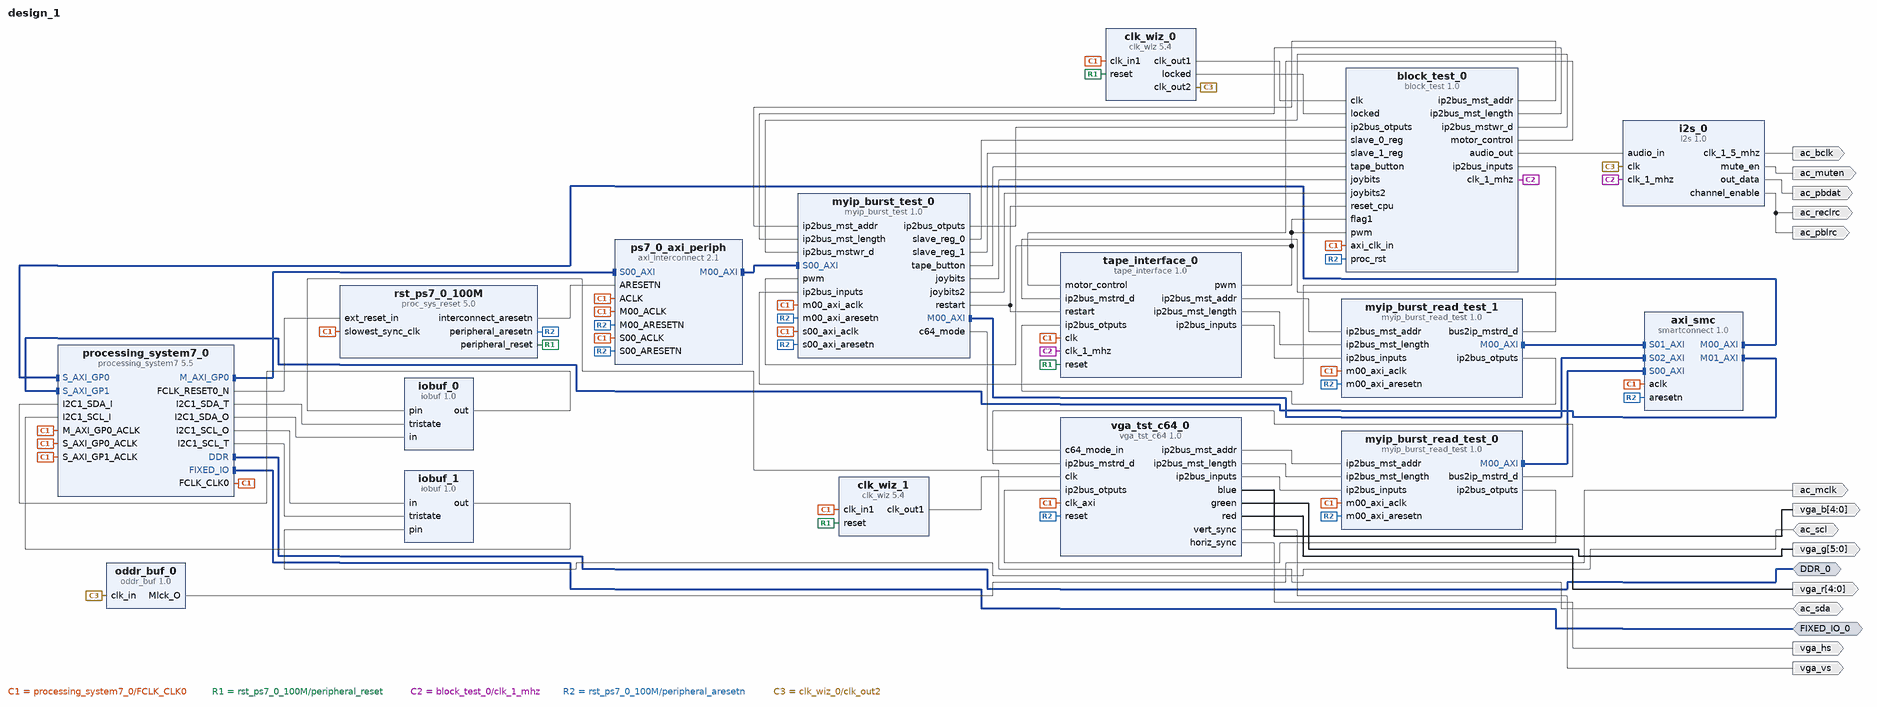
[diagram p0: block diagram of the top level]
# Vivado block design design_1, xc7z010clg400-1, Vivado 2017.1
create_bd_design design_1

create_bd_intf_port -mode Master -vlnv xilinx.com:interface:ddrx_rtl:1.0 DDR_0
create_bd_intf_port -mode Master -vlnv xilinx.com:display_processing_system7:fixedio_rtl:1.0 FIXED_IO_0
create_bd_port -dir O -from 4 -to 0 vga_r
create_bd_port -dir O -from 5 -to 0 vga_g
create_bd_port -dir O -from 4 -to 0 vga_b
create_bd_port -dir O vga_vs
create_bd_port -dir O vga_hs
create_bd_port -dir IO ac_sda
create_bd_port -dir IO ac_scl
create_bd_port -dir O ac_muten
create_bd_port -dir O ac_mclk
create_bd_port -dir O ac_bclk
create_bd_port -dir O ac_pbdat
create_bd_port -dir O ac_reclrc
create_bd_port -dir O ac_pblrc

create_bd_cell -type ip -vlnv xilinx.com:ip:clk_wiz:5.4 clk_wiz_0
set_property -dict [list \
  CONFIG.CLKOUT2_USED true \
  CONFIG.NUM_OUT_CLKS 2 \
  CONFIG.CLKOUT1_REQUESTED_OUT_FREQ 8 \
  CONFIG.CLKOUT2_REQUESTED_OUT_FREQ 12.288 \
  CONFIG.MMCM_DIVCLK_DIVIDE 1 \
  CONFIG.MMCM_CLKFBOUT_MULT_F 7.250 \
  CONFIG.MMCM_CLKOUT0_DIVIDE_F 90.625 \
  CONFIG.MMCM_CLKOUT1_DIVIDE 59 \
  CONFIG.CLKOUT1_JITTER 242.812 \
  CONFIG.CLKOUT1_PHASE_ERROR 119.384 \
  CONFIG.CLKOUT2_JITTER 223.282 \
  CONFIG.CLKOUT2_PHASE_ERROR 119.384 \
] [get_bd_cells clk_wiz_0]
create_bd_cell -type ip -vlnv user.org:user:myip_burst_read_test:1.0 myip_burst_read_test_0
create_bd_cell -type ip -vlnv xilinx.com:ip:clk_wiz:5.4 clk_wiz_1
set_property -dict [list \
  CONFIG.CLKOUT1_REQUESTED_OUT_FREQ 85.4 \
  CONFIG.MMCM_DIVCLK_DIVIDE 5 \
  CONFIG.MMCM_CLKFBOUT_MULT_F 53.375 \
  CONFIG.MMCM_CLKOUT0_DIVIDE_F 12.500 \
  CONFIG.CLKOUT1_JITTER 230.004 \
  CONFIG.CLKOUT1_PHASE_ERROR 297.994 \
] [get_bd_cells clk_wiz_1]
create_bd_cell -type ip -vlnv user.org:user:tape_interface:1.0 tape_interface_0
create_bd_cell -type ip -vlnv user.org:user:myip_burst_read_test:1.0 myip_burst_read_test_1
create_bd_cell -type ip -vlnv user.org:user:myip_burst_test:1.0 myip_burst_test_0
create_bd_cell -type ip -vlnv xilinx.com:ip:processing_system7:5.5 processing_system7_0
set_property -dict [list \
  CONFIG.PCW_UIPARAM_DDR_FREQ_MHZ 525 \
  CONFIG.PCW_CRYSTAL_PERIPHERAL_FREQMHZ 50.000000 \
  CONFIG.PCW_APU_PERIPHERAL_FREQMHZ 650 \
  CONFIG.PCW_SDIO_PERIPHERAL_FREQMHZ 50 \
  CONFIG.PCW_FPGA0_PERIPHERAL_FREQMHZ 100 \
  CONFIG.PCW_USE_S_AXI_GP0 1 \
  CONFIG.PCW_USE_S_AXI_GP1 1 \
  CONFIG.PCW_PRESET_BANK1_VOLTAGE {LVCMOS 1.8V} \
  CONFIG.PCW_UIPARAM_DDR_PARTNO {MT41K128M16 JT-125} \
  CONFIG.PCW_QSPI_PERIPHERAL_ENABLE 1 \
  CONFIG.PCW_QSPI_GRP_SINGLE_SS_ENABLE 1 \
  CONFIG.PCW_QSPI_GRP_FBCLK_ENABLE 1 \
  CONFIG.PCW_ENET0_PERIPHERAL_ENABLE 1 \
  CONFIG.PCW_ENET0_ENET0_IO {MIO 16 .. 27} \
  CONFIG.PCW_ENET0_GRP_MDIO_ENABLE 1 \
  CONFIG.PCW_SD0_PERIPHERAL_ENABLE 1 \
  CONFIG.PCW_SD0_GRP_CD_ENABLE 1 \
  CONFIG.PCW_SD0_GRP_CD_IO {MIO 47} \
  CONFIG.PCW_SD0_GRP_WP_ENABLE 1 \
  CONFIG.PCW_UART1_PERIPHERAL_ENABLE 1 \
  CONFIG.PCW_TTC0_PERIPHERAL_ENABLE 1 \
  CONFIG.PCW_USB0_PERIPHERAL_ENABLE 1 \
  CONFIG.PCW_I2C1_PERIPHERAL_ENABLE 1 \
  CONFIG.PCW_GPIO_MIO_GPIO_ENABLE 1 \
] [get_bd_cells processing_system7_0]
# 105 more settings of processing_system7_0 are not shown: defaults, MIO pin electricals, DDR timing, and values the tool derives
create_bd_cell -type ip -vlnv xilinx.com:ip:smartconnect:1.0 axi_smc
set_property -dict {CONFIG.NUM_MI 2 CONFIG.NUM_SI 3} [get_bd_cells axi_smc]
create_bd_cell -type ip -vlnv xilinx.com:ip:proc_sys_reset:5.0 rst_ps7_0_100M
create_bd_cell -type ip -vlnv xilinx.com:ip:axi_interconnect:2.1 ps7_0_axi_periph
set_property -dict {CONFIG.NUM_MI 1} [get_bd_cells ps7_0_axi_periph]
create_bd_cell -type ip -vlnv user.org:user:block_test:1.0 block_test_0
create_bd_cell -type ip -vlnv user.org:user:vga_tst_c64:1.0 vga_tst_c64_0
create_bd_cell -type ip -vlnv user.org:user:i2s:1.0 i2s_0
create_bd_cell -type ip -vlnv user.org:user:iobuf:1.0 iobuf_0
create_bd_cell -type ip -vlnv user.org:user:iobuf:1.0 iobuf_1
create_bd_cell -type ip -vlnv user.org:user:oddr_buf:1.0 oddr_buf_0

# ---- connections ----

connect_bd_intf_net [get_bd_intf_pins myip_burst_read_test_0/M00_AXI] [get_bd_intf_pins axi_smc/S00_AXI]
connect_bd_intf_net [get_bd_intf_pins axi_smc/M00_AXI] [get_bd_intf_pins processing_system7_0/S_AXI_GP0]
connect_bd_intf_net [get_bd_intf_pins axi_smc/M01_AXI] [get_bd_intf_pins processing_system7_0/S_AXI_GP1]
connect_bd_intf_net [get_bd_intf_pins myip_burst_read_test_1/M00_AXI] [get_bd_intf_pins axi_smc/S01_AXI]
connect_bd_intf_net [get_bd_intf_pins processing_system7_0/M_AXI_GP0] [get_bd_intf_pins ps7_0_axi_periph/S00_AXI]
connect_bd_intf_net [get_bd_intf_pins ps7_0_axi_periph/M00_AXI] [get_bd_intf_pins myip_burst_test_0/S00_AXI]
connect_bd_intf_net [get_bd_intf_pins myip_burst_test_0/M00_AXI] [get_bd_intf_pins axi_smc/S02_AXI]
connect_bd_intf_net [get_bd_intf_ports DDR_0] [get_bd_intf_pins processing_system7_0/DDR]
connect_bd_intf_net [get_bd_intf_ports FIXED_IO_0] [get_bd_intf_pins processing_system7_0/FIXED_IO]
connect_bd_net [get_bd_pins processing_system7_0/FCLK_CLK0] \
  [get_bd_pins clk_wiz_0/clk_in1] [get_bd_pins myip_burst_read_test_0/m00_axi_aclk] [get_bd_pins clk_wiz_1/clk_in1] \
  [get_bd_pins myip_burst_test_0/s00_axi_aclk] [get_bd_pins myip_burst_test_0/m00_axi_aclk] \
  [get_bd_pins tape_interface_0/clk] [get_bd_pins axi_smc/aclk] [get_bd_pins rst_ps7_0_100M/slowest_sync_clk] \
  [get_bd_pins processing_system7_0/S_AXI_GP0_ACLK] [get_bd_pins processing_system7_0/S_AXI_GP1_ACLK] \
  [get_bd_pins myip_burst_read_test_1/m00_axi_aclk] [get_bd_pins processing_system7_0/M_AXI_GP0_ACLK] \
  [get_bd_pins block_test_0/axi_clk_in] [get_bd_pins vga_tst_c64_0/clk_axi] [get_bd_pins ps7_0_axi_periph/M00_ACLK] \
  [get_bd_pins ps7_0_axi_periph/S00_ACLK] [get_bd_pins ps7_0_axi_periph/ACLK]
connect_bd_net [get_bd_pins rst_ps7_0_100M/peripheral_reset] \
  [get_bd_pins clk_wiz_0/reset] [get_bd_pins clk_wiz_1/reset] [get_bd_pins tape_interface_0/reset]
connect_bd_net [get_bd_pins clk_wiz_1/clk_out1] [get_bd_pins vga_tst_c64_0/clk]
connect_bd_net [get_bd_pins myip_burst_read_test_0/bus2ip_mstrd_d] [get_bd_pins vga_tst_c64_0/ip2bus_mstrd_d]
connect_bd_net [get_bd_pins myip_burst_read_test_0/ip2bus_otputs] [get_bd_pins vga_tst_c64_0/ip2bus_otputs]
connect_bd_net [get_bd_pins vga_tst_c64_0/ip2bus_mst_addr] [get_bd_pins myip_burst_read_test_0/ip2bus_mst_addr]
connect_bd_net [get_bd_pins vga_tst_c64_0/ip2bus_mst_length] [get_bd_pins myip_burst_read_test_0/ip2bus_mst_length]
connect_bd_net [get_bd_pins vga_tst_c64_0/ip2bus_inputs] [get_bd_pins myip_burst_read_test_0/ip2bus_inputs]
connect_bd_net [get_bd_pins vga_tst_c64_0/red] [get_bd_ports vga_r]
connect_bd_net [get_bd_pins vga_tst_c64_0/green] [get_bd_ports vga_g]
connect_bd_net [get_bd_pins vga_tst_c64_0/blue] [get_bd_ports vga_b]
connect_bd_net [get_bd_pins vga_tst_c64_0/vert_sync] [get_bd_ports vga_vs]
connect_bd_net [get_bd_pins vga_tst_c64_0/horiz_sync] [get_bd_ports vga_hs]
connect_bd_net [get_bd_pins clk_wiz_0/clk_out1] [get_bd_pins block_test_0/clk]
connect_bd_net [get_bd_pins myip_burst_test_0/ip2bus_otputs] [get_bd_pins block_test_0/ip2bus_otputs]
connect_bd_net [get_bd_pins myip_burst_test_0/slave_reg_0] [get_bd_pins block_test_0/slave_0_reg]
connect_bd_net [get_bd_pins myip_burst_test_0/slave_reg_1] [get_bd_pins block_test_0/slave_1_reg]
connect_bd_net [get_bd_pins block_test_0/ip2bus_mst_addr] [get_bd_pins myip_burst_test_0/ip2bus_mst_addr]
connect_bd_net [get_bd_pins block_test_0/ip2bus_mst_length] [get_bd_pins myip_burst_test_0/ip2bus_mst_length]
connect_bd_net [get_bd_pins block_test_0/ip2bus_mstwr_d] [get_bd_pins myip_burst_test_0/ip2bus_mstwr_d]
connect_bd_net [get_bd_pins block_test_0/ip2bus_inputs] [get_bd_pins myip_burst_test_0/ip2bus_inputs]
connect_bd_net [get_bd_pins block_test_0/clk_1_mhz] [get_bd_pins tape_interface_0/clk_1_mhz] [get_bd_pins i2s_0/clk_1_mhz]
connect_bd_net [get_bd_pins myip_burst_test_0/restart] [get_bd_pins tape_interface_0/restart] [get_bd_pins block_test_0/reset_cpu]
connect_bd_net [get_bd_pins myip_burst_read_test_1/bus2ip_mstrd_d] [get_bd_pins tape_interface_0/ip2bus_mstrd_d]
connect_bd_net [get_bd_pins myip_burst_read_test_1/ip2bus_otputs] [get_bd_pins tape_interface_0/ip2bus_otputs]
connect_bd_net [get_bd_pins block_test_0/motor_control] [get_bd_pins tape_interface_0/motor_control]
connect_bd_net [get_bd_pins clk_wiz_0/locked] [get_bd_pins block_test_0/locked]
connect_bd_net [get_bd_pins tape_interface_0/pwm] [get_bd_pins myip_burst_test_0/pwm] [get_bd_pins block_test_0/pwm] [get_bd_pins block_test_0/flag1]
connect_bd_net [get_bd_pins tape_interface_0/ip2bus_mst_addr] [get_bd_pins myip_burst_read_test_1/ip2bus_mst_addr]
connect_bd_net [get_bd_pins tape_interface_0/ip2bus_mst_length] [get_bd_pins myip_burst_read_test_1/ip2bus_mst_length]
connect_bd_net [get_bd_pins tape_interface_0/ip2bus_inputs] [get_bd_pins myip_burst_read_test_1/ip2bus_inputs]
connect_bd_net [get_bd_pins myip_burst_test_0/tape_button] [get_bd_pins block_test_0/tape_button]
connect_bd_net [get_bd_pins myip_burst_test_0/joybits] [get_bd_pins block_test_0/joybits]
connect_bd_net [get_bd_pins myip_burst_test_0/joybits2] [get_bd_pins block_test_0/joybits2]
connect_bd_net [get_bd_pins processing_system7_0/FCLK_RESET0_N] [get_bd_pins rst_ps7_0_100M/ext_reset_in]
connect_bd_net [get_bd_pins rst_ps7_0_100M/peripheral_aresetn] \
  [get_bd_pins myip_burst_read_test_0/m00_axi_aresetn] [get_bd_pins myip_burst_test_0/s00_axi_aresetn] \
  [get_bd_pins myip_burst_test_0/m00_axi_aresetn] [get_bd_pins axi_smc/aresetn] \
  [get_bd_pins myip_burst_read_test_1/m00_axi_aresetn] [get_bd_pins vga_tst_c64_0/reset] [get_bd_pins block_test_0/proc_rst] \
  [get_bd_pins ps7_0_axi_periph/M00_ARESETN] [get_bd_pins ps7_0_axi_periph/S00_ARESETN]
connect_bd_net [get_bd_pins rst_ps7_0_100M/interconnect_aresetn] [get_bd_pins ps7_0_axi_periph/ARESETN]
connect_bd_net [get_bd_pins myip_burst_test_0/c64_mode] [get_bd_pins vga_tst_c64_0/c64_mode_in]
connect_bd_net [get_bd_pins processing_system7_0/I2C1_SDA_T] [get_bd_pins iobuf_0/tristate]
connect_bd_net [get_bd_pins processing_system7_0/I2C1_SDA_O] [get_bd_pins iobuf_0/in]
connect_bd_net [get_bd_pins iobuf_0/out] [get_bd_pins processing_system7_0/I2C1_SDA_I]
connect_bd_net [get_bd_pins processing_system7_0/I2C1_SCL_O] [get_bd_pins iobuf_1/in]
connect_bd_net [get_bd_pins processing_system7_0/I2C1_SCL_T] [get_bd_pins iobuf_1/tristate]
connect_bd_net [get_bd_pins iobuf_1/out] [get_bd_pins processing_system7_0/I2C1_SCL_I]
connect_bd_net [get_bd_pins clk_wiz_0/clk_out2] [get_bd_pins oddr_buf_0/clk_in] [get_bd_pins i2s_0/clk]
connect_bd_net [get_bd_pins block_test_0/audio_out] [get_bd_pins i2s_0/audio_in]
connect_bd_net [get_bd_ports ac_sda] [get_bd_pins iobuf_0/pin]
connect_bd_net [get_bd_ports ac_scl] [get_bd_pins iobuf_1/pin]
connect_bd_net [get_bd_pins i2s_0/mute_en] [get_bd_ports ac_muten]
connect_bd_net [get_bd_pins oddr_buf_0/Mlck_O] [get_bd_ports ac_mclk]
connect_bd_net [get_bd_pins i2s_0/clk_1_5_mhz] [get_bd_ports ac_bclk]
connect_bd_net [get_bd_pins i2s_0/out_data] [get_bd_ports ac_pbdat]
connect_bd_net [get_bd_pins i2s_0/channel_enable] [get_bd_ports ac_pblrc] [get_bd_ports ac_reclrc]

# ---- address map ----
assign_bd_address -offset 0x00000000 -range 512M -target_address_space [get_bd_addr_spaces myip_burst_read_test_0/M00_AXI] [get_bd_addr_segs processing_system7_0/S_AXI_GP0/GP0_DDR_LOWOCM]
assign_bd_address -offset 0x10000000 -range 256M -target_address_space [get_bd_addr_spaces myip_burst_read_test_1/M00_AXI] [get_bd_addr_segs processing_system7_0/S_AXI_GP1/GP1_DDR_LOWOCM]
assign_bd_address -offset 0x10000000 -range 256M -target_address_space [get_bd_addr_spaces myip_burst_test_0/M00_AXI] [get_bd_addr_segs processing_system7_0/S_AXI_GP1/GP1_DDR_LOWOCM]
assign_bd_address -offset 0x43C00000 -range 64K -target_address_space [get_bd_addr_spaces processing_system7_0/Data] [get_bd_addr_segs myip_burst_test_0/S00_AXI/S00_AXI_reg]

validate_bd_design
save_bd_design
